# Altium schematic sheet High_Level_Connections.SchDoc
size A; SheetNumber: 2; SheetTotal: 16
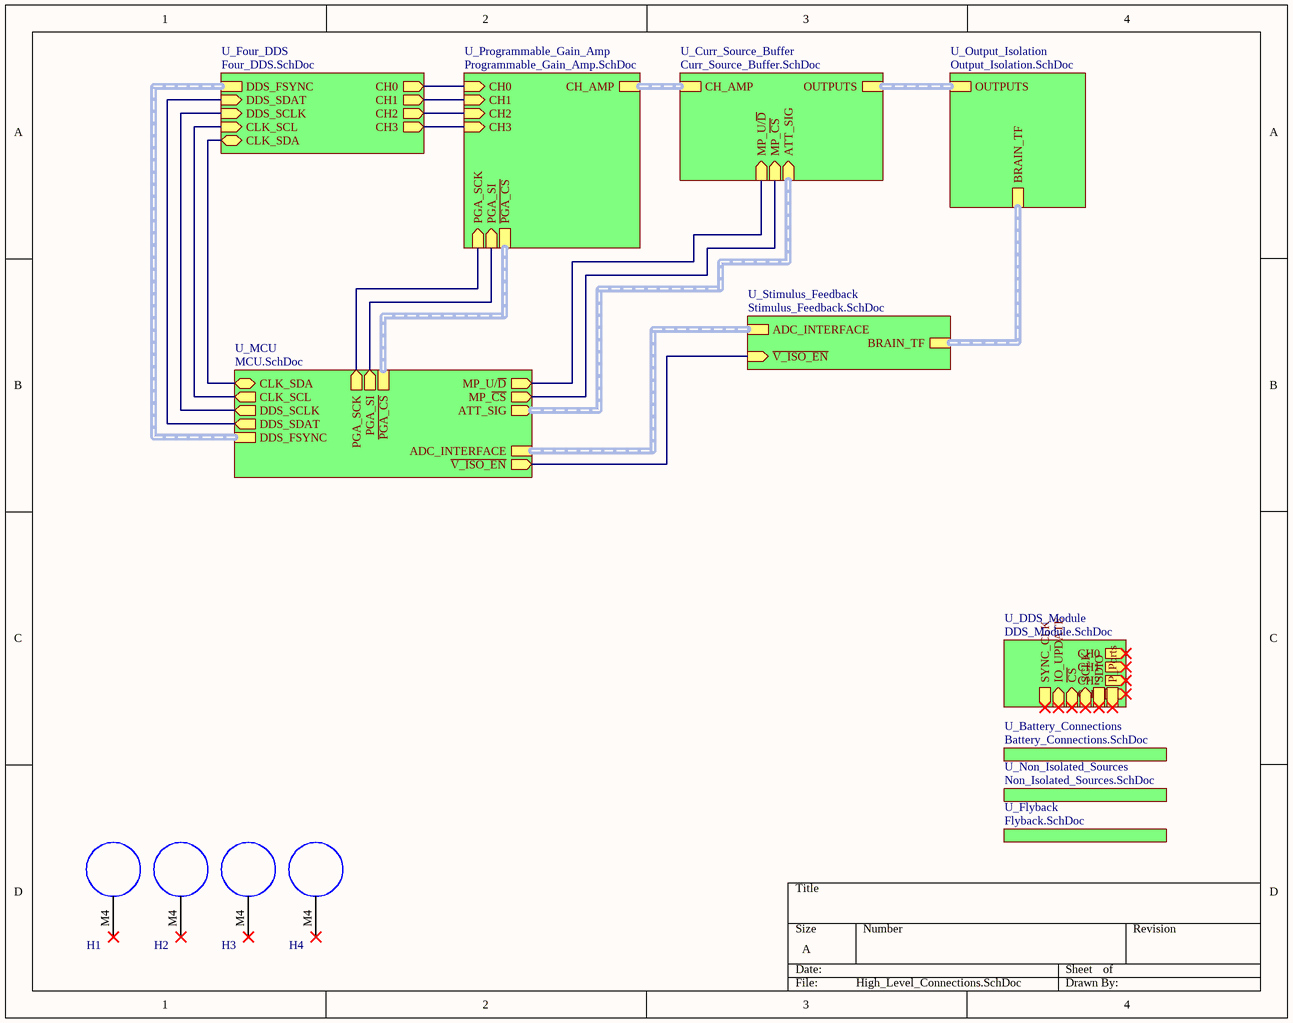
[diagram p0: High_Level_Connections.SchDoc]

## Parts
H1  M4 Mounting Hole  [Mounting Hole]  (value not drawn)
H2  M4 Mounting Hole  [Mounting Hole]  (value not drawn)
H3  M4 Mounting Hole  [Mounting Hole]  (value not drawn)
H4  M4 Mounting Hole  [Mounting Hole]  (value not drawn)

## Sub-sheets
U_Battery_Connections = Battery_Connections.SchDoc: no entries
U_Curr_Source_Buffer = Curr_Source_Buffer.SchDoc: OUTPUTS (harness OUTPUT_VOLTAGES), CH_AMP (harness CHANNEL_AMP), MP_U/~{D} (in), MP_~{CS} (in), ATT_SIG (in)
U_DDS_Module = DDS_Module.SchDoc: CH0 (out), CH1 (out), CH2 (out), CH3 (out), IO_UPDATE (in), ~{CS} (in), SCLK (in), SYNC_CLK (out), SDIO (harness SDIO), P_Ports (harness P)
U_Flyback = Flyback.SchDoc: no entries
U_Four_DDS = Four_DDS.SchDoc: DDS_FSYNC (harness DDS_FSYNC), DDS_SDAT (in), DDS_SCLK (in), CLK_SCL (in), CLK_SDA (bidir), CH0 (out), CH1 (out), CH2 (out), CH3 (out)
U_MCU = MCU.SchDoc: ADC_INTERFACE (harness ADC_DATA), ~{PGA_CS} (harness PGA_CS), PGA_SCK (out), PGA_SI (out), DDS_SDAT (out), DDS_SCLK (out), ATT_SIG (out), MP_U/~{D} (out), MP_~{CS} (out), DDS_FSYNC (harness DDS_FSYNC), ~{V_ISO_EN} (out), CLK_SCL (out), CLK_SDA (bidir)
U_Non_Isolated_Sources = Non_Isolated_Sources.SchDoc: no entries
U_Output_Isolation = Output_Isolation.SchDoc: OUTPUTS (harness OUTPUT_VOLTAGES), BRAIN_TF (harness Brain_Trans_Conn)
U_Programmable_Gain_Amp = Programmable_Gain_Amp.SchDoc: CH0 (in), CH1 (in), CH2 (in), CH3 (in), PGA_SCK (in), PGA_SI (in), ~{PGA_CS} (harness PGA_CS), CH_AMP (harness CHANNEL_AMP)
U_Stimulus_Feedback = Stimulus_Feedback.SchDoc: BRAIN_TF (harness Brain_Trans_Conn), ADC_INTERFACE (harness ADC_DATA), ~{V_ISO_EN} (in)

## Nets
(unnamed): sheet U_Programmable_Gain_Amp/CH0, sheet U_Four_DDS/CH0
(unnamed): sheet U_Programmable_Gain_Amp/CH1, sheet U_Four_DDS/CH1
(unnamed): sheet U_Programmable_Gain_Amp/CH2, sheet U_Four_DDS/CH2
(unnamed): sheet U_Programmable_Gain_Amp/CH3, sheet U_Four_DDS/CH3
(unnamed): sheet U_Programmable_Gain_Amp/PGA_SCK, sheet U_MCU/PGA_SCK
(unnamed): sheet U_Programmable_Gain_Amp/PGA_SI, sheet U_MCU/PGA_SI
(unnamed): sheet U_Stimulus_Feedback/~{V_ISO_EN}, sheet U_MCU/~{V_ISO_EN}
(unnamed): sheet U_Four_DDS/DDS_SDAT, sheet U_MCU/DDS_SDAT
(unnamed): sheet U_Four_DDS/DDS_SCLK, sheet U_MCU/DDS_SCLK
(unnamed): sheet U_Four_DDS/CLK_SCL, sheet U_MCU/CLK_SCL
(unnamed): sheet U_Four_DDS/CLK_SDA, sheet U_MCU/CLK_SDA
(unnamed): sheet U_Curr_Source_Buffer/MP_U/~{D}, sheet U_MCU/MP_U/~{D}
(unnamed): sheet U_Curr_Source_Buffer/MP_~{CS}, sheet U_MCU/MP_~{CS}

Not connected (* = marked no-connect by the designer): H1 M4*; H2 M4*; H3 M4*; H4 M4*

## Buses and harness runs
harness sheet U_Curr_Source_Buffer/ATT_SIG = sheet U_MCU/ATT_SIG
harness sheet U_Curr_Source_Buffer/CH_AMP = sheet U_Programmable_Gain_Amp/CH_AMP
harness sheet U_Curr_Source_Buffer/OUTPUTS = sheet U_Output_Isolation/OUTPUTS
harness sheet U_Four_DDS/DDS_FSYNC = sheet U_MCU/DDS_FSYNC
harness sheet U_MCU/ADC_INTERFACE = sheet U_Stimulus_Feedback/ADC_INTERFACE
harness sheet U_MCU/~{PGA_CS} = sheet U_Programmable_Gain_Amp/~{PGA_CS}
harness sheet U_Output_Isolation/BRAIN_TF = sheet U_Stimulus_Feedback/BRAIN_TF

## Library data of the parts
H1-H4 = MOUNTING HOLE M4